# EAGLE design SparkFun MMA8452Q (EAGLE 9.3.2)
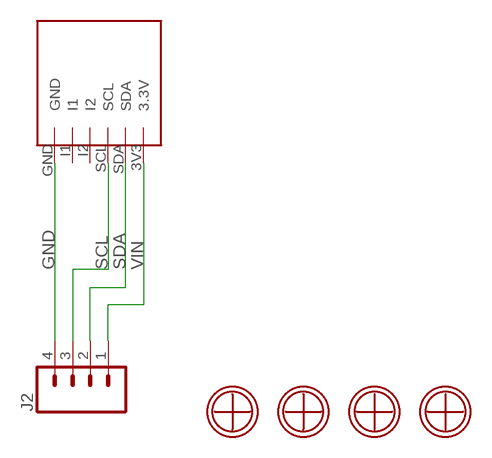
[diagram p0: schematic, sheet 1]

## Parts
J2  CONN_04  [1X04]
U$1  3.2MM-5MM  [3.2MM-5MM]
U$2  3.2MM-5MM  [3.2MM-5MM]
U$3  3.2MM-5MM  [3.2MM-5MM]
U$4  3.2MM-5MM  [3.2MM-5MM]
U$5  MMA8542Q  [MMA8542Q]

## Nets
GND: J2.4 U$5.GND
SCL: J2.3 U$5.SCL
SDA: J2.2 U$5.SDA
VIN: J2.1 U$5.3V3(3.3V)
Unconnected: U$1.P$1 U$2.P$1 U$3.P$1 U$4.P$1 U$5.I1 U$5.I2

## Library data of the parts
J2 = SparkFun-Connectors:CONN_04: Multi connection point. Often used as Generic Header-pin footprint for 0.1 inch spaced/style header connections On any of the 0.1 inch spaced packages, you can populate with these: Break Away Headers - Straight <https://www.sparkfun.com/products/116> (PRT-00116) Break Away Male Headers - Right Angle <https://www.sparkfun.com/products/553> (PRT-00553) Female Headers <https://www.sparkfun.com/products/115> (PRT-00115) Break Away Headers - Machine Pin <https://www.sparkfun.com/products/117> (PRT-00117) Break Away Female Headers - Swiss Machine Pin <https://www.sparkfun.com/products/743> (PRT-00743) For SCREWTERMINALS and SPRING TERMINALS visit here: Screw Terimnals on SparkFun.com <https://www.sparkfun.com/search/results?term=Screw+Terminals> (5mm/3.5mm/2.54mm spacing) This device is also useful as a general connection point to wire up your design to another part of your project. Our various solder wires solder well into these plated through hole pads. Hook-Up Wire - Assortment (Stranded, 22 AWG) <https://www.sparkfun.com/products/11375> (PRT-11375) Hook-Up Wire - Assortment (Solid Core, 22 AWG) <https://www.sparkfun.com/products/11367> (PRT-11367) View the entire wire category on our website here <https://www.sparkfun.com/categories/141> Special notes: Molex polarized connector foot print use with SKU : PRT-08231 with associated crimp pins and housings. 1MM SMD Version SKU: PRT-10208; PROD_ID: CONN-09696
U$1-U$4 = #Holes:3.2MM-5MM
U$5 = #MMA8542Q:MMA8542Q

## Board
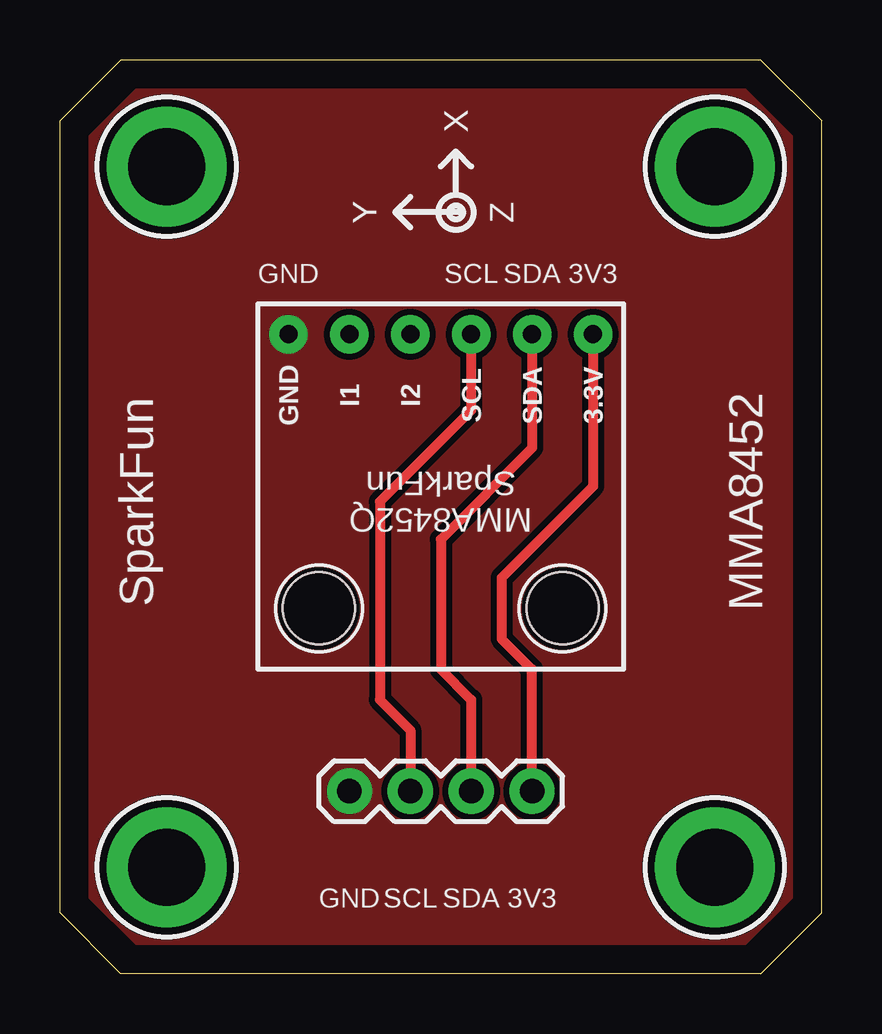
[diagram p1: board, top side]
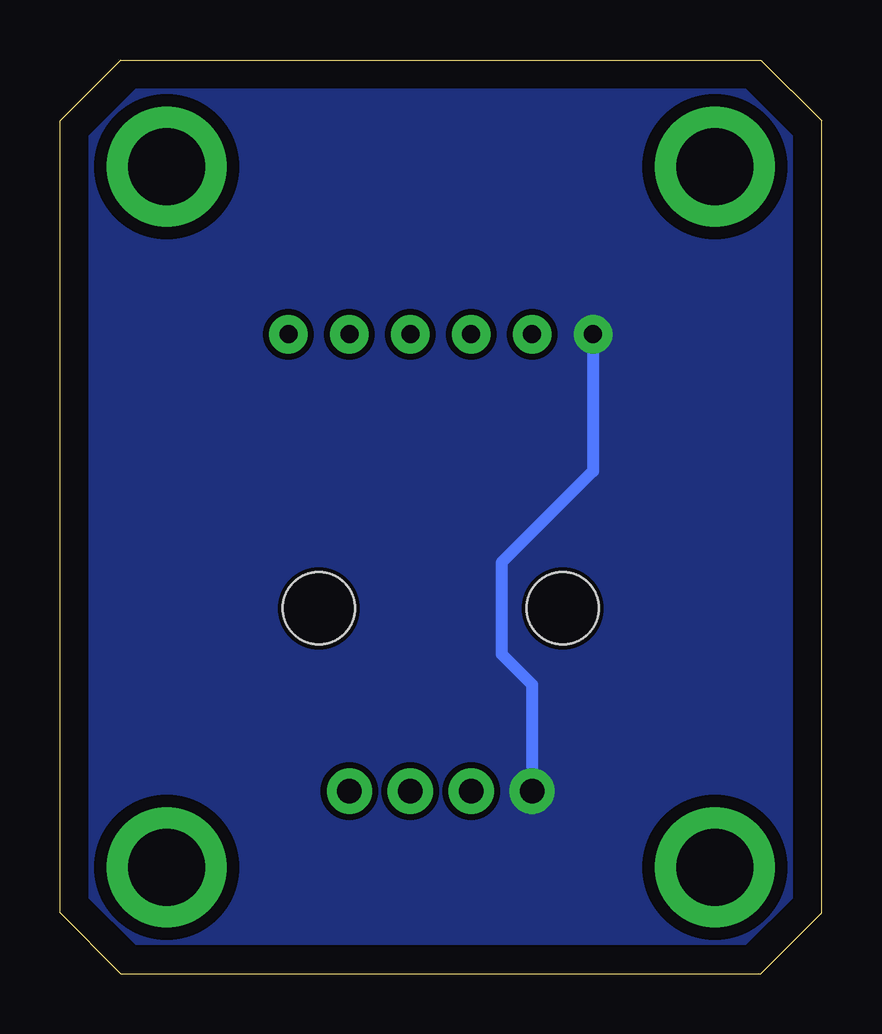
[diagram p2: board, bottom side, seen from below]

Size 31.75 x 38.1 mm. Coordinates in mm from the lower left corner, seen from the top.
Outline: 29.21,0 2.54,0 0,2.54 0,35.56 2.54,38.1 29.21,38.1 31.75,35.56 31.75,2.54 29.21,0
Copper layers (1*16): Top 0.035mm / dielectric 1.5mm / Bottom 0.035mm
Design rules "SparkFun 2 Layer Design Rule - STANDARD": minimum track width 10mil, minimum drill 20mil, track to track 10mil, track to pad 8mil, pad to pad 8mil, via to via 10mil, smd to smd 8mil, copper to edge 8mil, drill to drill 8mil, minimum pad ring 10mil, minimum via ring 10mil, stop-mask expansion 4mil, vias tented up to drill 25mil, thermal gap 10mil

### Footprints (pad centres in the part's own frame; a part is rotated, then mirrored left to right if it is on the bottom)
1X04 = drill 1.016 pad 1.88: 1 0,0; 2 2.54,0; 3 5.08,0; 4 7.62,0
3.2MM-5MM = drill 3.2 pad 5: P$1 0,0
MMA8542Q = drill 0.75 pad 1.6: 3V3 13.97,1.27; GND 13.97,13.97; I1 13.97,11.43; I2 13.97,8.89; SCL 13.97,6.35; SDA 13.97,3.81 | hole 3: 2.54,2.54; 2.54,12.7

### Placement (x,y rotation side)
J2  19.69,7.62 180 top
U$1  4.45,33.66 0 top
U$2  27.3,33.66 0 top
U$3  4.45,4.45 0 top
U$4  27.3,4.45 0 top
U$5  23.5,12.7 90 top

### Tracks (layer width: path | path; a pad name or v marks a point on that pad's centre or on a via)
GND
  Bottom 0.508: U$5.GND 9.53,20.95 13.33,17.14 13.33,13.34 12.06,12.06 J2.4
  pour Bottom (no thermals): 3.18,36.83 28.57,36.83 30.48,34.92 30.48,3.17 28.57,1.27 3.18,1.27 1.27,3.17 1.27,34.92
  pour Top (no thermals): 3.18,36.83 28.57,36.83 30.48,34.92 30.48,3.17 28.57,1.27 3.18,1.27 1.27,3.17 1.27,34.92
SCL
  Top 0.406: J2.3 14.6,10.16 13.33,11.43 13.33,19.68 17.14,23.5 U$5.SCL
SDA
  Top 0.406: U$5.SDA 19.69,21.93 15.87,18.12 15.87,12.7 17.14,11.43 J2.2
VIN
  Top 0.406: U$5.3V3 22.23,20.32 18.42,16.51 18.42,13.97 19.69,12.7 J2.1

### Text on the board
tPlace: X | Y | Z
tNames: GND | SCL | SDA | 3V3 | SparkFun | MMA8452 | GND | SCL | SDA | 3V3